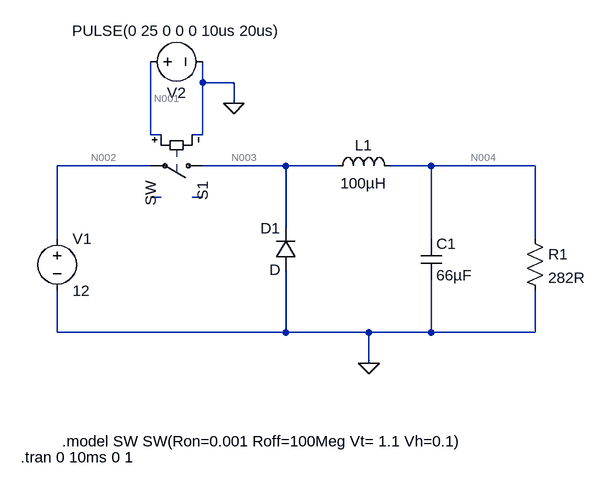
[diagram p0: schematic Draft1.asc]
Draft1.asc, the LTspice schematic file:
Version 4
SHEET 1 880 680
WIRE 128 -112 128 -144
WIRE 176 -112 128 -112
WIRE 176 -80 176 -112
WIRE 48 -32 48 -144
WIRE 64 -32 48 -32
WIRE 128 -32 128 -112
WIRE 128 -32 112 -32
WIRE 48 16 -96 16
WIRE 256 16 128 16
WIRE 336 16 256 16
WIRE 480 16 416 16
WIRE 640 16 480 16
WIRE 64 64 48 64
WIRE 128 64 112 64
WIRE 256 112 256 16
WIRE -96 128 -96 16
WIRE 480 128 480 16
WIRE 640 128 640 16
WIRE -96 272 -96 208
WIRE 256 272 256 176
WIRE 256 272 -96 272
WIRE 384 272 256 272
WIRE 480 272 480 192
WIRE 480 272 384 272
WIRE 640 272 640 208
WIRE 640 272 480 272
WIRE 384 320 384 272
FLAG 384 320 0
FLAG 176 -80 0
SYMBOL voltage -96 112 R0
WINDOW 123 0 0 Left 0
WINDOW 39 0 0 Left 0
SYMATTR InstName V1
SYMATTR Value 12
SYMBOL res 624 112 R0
SYMATTR InstName R1
SYMATTR Value 282R
SYMBOL cap 464 128 R0
SYMATTR InstName C1
SYMATTR Value 66µF
SYMBOL sw 144 16 R90
SYMATTR InstName S1
SYMBOL ind 320 32 R270
WINDOW 0 32 56 VTop 2
WINDOW 3 5 56 VBottom 2
SYMATTR InstName L1
SYMATTR Value 100µH
SYMBOL voltage 32 -144 R270
WINDOW 0 -32 56 VBottom 2
WINDOW 3 32 56 VTop 2
WINDOW 123 0 0 Left 0
WINDOW 39 0 0 Left 0
SYMATTR InstName V2
SYMATTR Value PULSE(0 25 0 0 0 10us 20us)
SYMBOL diode 272 176 R180
WINDOW 0 24 64 Left 2
WINDOW 3 24 0 Left 2
SYMATTR InstName D1
TEXT -88 440 Left 2 !.model SW SW(Ron=0.001 Roff=100Meg Vt= 1.1 Vh=0.1)
TEXT -152 464 Left 2 !.tran 0 10ms 0 1

The netlist it stands for:
* Draft1.asc
V1 N002 0 12
R1 N004 0 282R
C1 N004 0 66µF
S1 N003 N002 N001 0 SW
L1 N003 N004 100µH
V2 N001 0 PULSE(0 25 0 0 0 10us 20us)
D1 0 N003 D
.model D D
.lib standard.dio
.model SW SW(Ron=0.001 Roff=100Meg Vt= 1.1 Vh=0.1)
.tran 0 10ms 0 1
.backanno
.end

* Results of the author's LTspice run, read from the files saved beside the schematic
* Operating Point, zero values left out:
*   V(n002) = 12 V
*   V(n004) = 33.84 µV
*   V(n003) = 33.84 µV
*   I(L1) = 120 nA
*   I(R1) = 120 nA
*   I(S1) = 120 nA
*   I(V1) = -120 nA
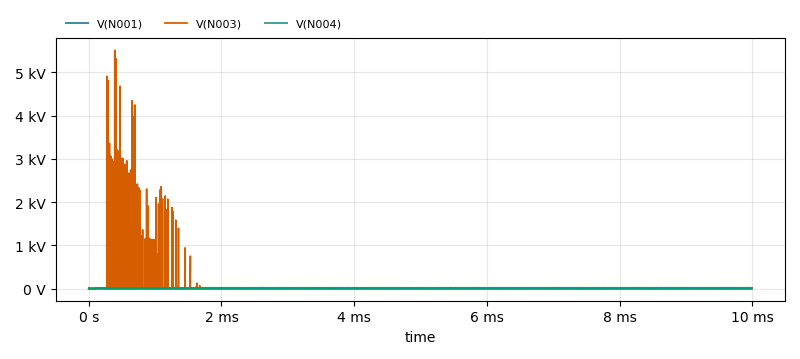
[diagram p1: Transient Analysis of Draft1.asc, plotted from the saved traces]
* Transient Analysis, 1 run:
*   V(N001): min 0 V, max 25.01 V, average 13.75 V, rms 18.47 V, last 0 V
*   V(N003): min -879.1 mV, max 5.726 kV, average 11.26 V, rms 15.76 V, last 10.99 V
*   V(N004): min 33.84 µV, max 13.43 V, average 11.27 V, rms 11.33 V, last 10.99 V